# Altium schematic sheet Notes.SchDoc
size A4; DocumentNumber: 2; SheetNumber: 2; SheetTotal: 2
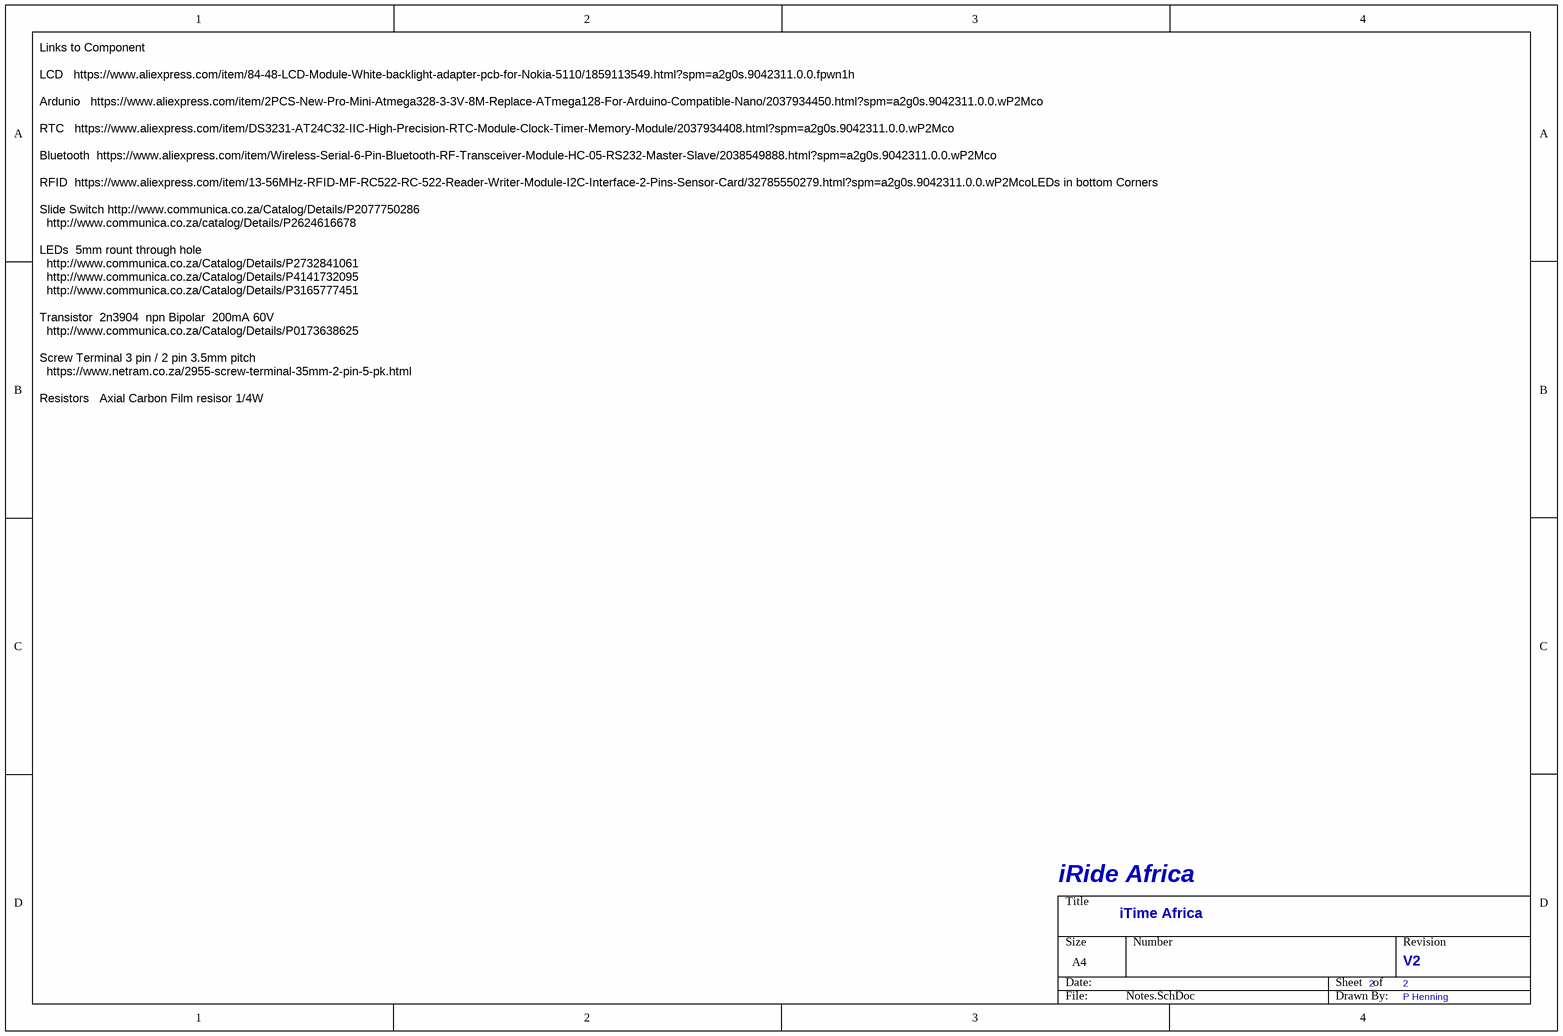
[diagram p0: Notes.SchDoc]

## Notes on the sheet
- Links to Component
  LCD 		https://www.aliexpress.com/item/84-48-LCD-Module-White-backlight-adapter-pcb-for-Nokia-5110/1859113549.html?spm=a2g0s.9042311.0.0.fpwn1h
  Ardunio 		https://www.aliexpress.com/item/2PCS-New-Pro-Mini-Atmega328-3-3V-8M-Replace-ATmega128-For-Arduino-Compatible-Nano/2037934450.html?spm=a2g0s.9042311.0.0.wP2Mco
  RTC 		https://www.aliexpress.com/item/DS3231-AT24C32-IIC-High-Precision-RTC-Module-Clock-Timer-Memory-Module/2037934408.html?spm=a2g0s.9042311.0.0.wP2Mco
  Bluetooth		https://www.aliexpress.com/item/Wireless-Serial-6-Pin-Bluetooth-RF-Transceiver-Module-HC-05-RS232-Master-Slave/2038549888.html?spm=a2g0s.9042311.0.0.wP2Mco
  RFID		https://www.aliexpress.com/item/13-56MHz-RFID-MF-RC522-RC-522-Reader-Writer-Module-I2C-Interface-2-Pins-Sensor-Card/32785550279.html?spm=a2g0s.9042311.0.0.wP2McoLEDs in bottom Corners
  Slide Switch	http://www.communica.co.za/Catalog/Details/P2077750286
  http://www.communica.co.za/catalog/Details/P2624616678
  LEDs		5mm rount through hole
  http://www.communica.co.za/Catalog/Details/P2732841061
  http://www.communica.co.za/Catalog/Details/P4141732095
  http://www.communica.co.za/Catalog/Details/P3165777451
  Transistor		2n3904  npn Bipolar  200mA 60V
  http://www.communica.co.za/Catalog/Details/P0173638625
  Screw Terminal	3 pin / 2 pin 3.5mm pitch
  https://www.netram.co.za/2955-screw-terminal-35mm-2-pin-5-pk.html
  Resistors  	Axial Carbon Film resisor 1/4W
- iRide Africa
- iTime Africa
- 2
- V2
- P Henning